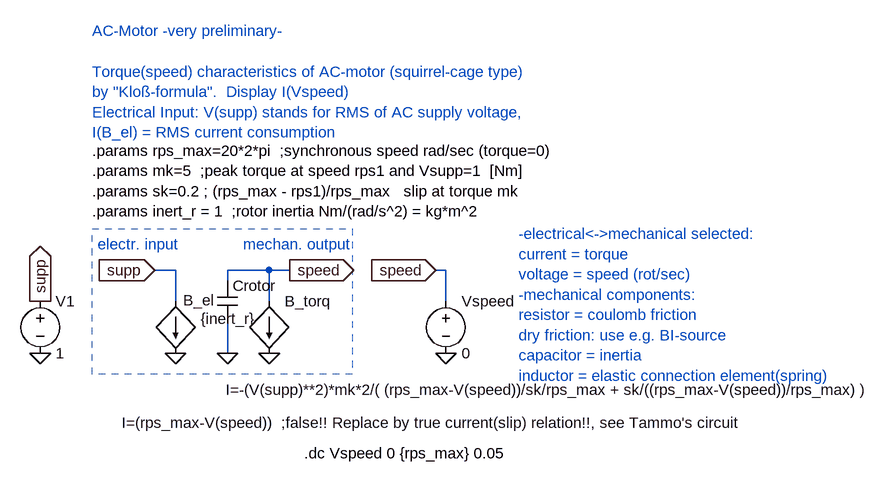
[diagram p0: schematic AC_motor_torque_speed.asc]
AC_motor_torque_speed.asc, the LTspice schematic file:
Version 4
SHEET 1 1300 916
WIRE 96 144 64 144
WIRE 96 192 96 144
WIRE 176 160 176 144
WIRE 176 272 176 224
WIRE 240 144 176 144
WIRE 240 192 240 144
WIRE 272 144 240 144
WIRE 512 144 496 144
WIRE 512 192 512 144
FLAG 240 272 0
FLAG 512 272 0
FLAG 272 144 speed
IOPIN 272 144 Out
FLAG -112 272 0
FLAG -112 192 supp
IOPIN -112 192 Out
FLAG 96 272 0
FLAG 64 144 supp
IOPIN 64 144 In
FLAG 496 144 speed
IOPIN 496 144 In
FLAG 176 272 0
SYMBOL bi 240 192 R0
WINDOW 3 -67 136 Left 0
SYMATTR Value I=-(V(supp)**2)*mk*2/( (rps_max-V(speed))/sk/rps_max + sk/((rps_max-V(speed))/rps_max) )
SYMATTR InstName B_torq
SYMBOL voltage 512 176 R0
WINDOW 123 0 0 Left 0
WINDOW 39 0 0 Left 0
SYMATTR InstName Vspeed
SYMATTR Value 0
SYMBOL voltage -112 176 R0
WINDOW 123 0 0 Left 0
WINDOW 39 0 0 Left 0
SYMATTR InstName V1
SYMATTR Value 1
SYMBOL bi 96 192 R0
WINDOW 3 -83 187 Left 0
WINDOW 0 12 -2 Left 0
SYMATTR Value I=(rps_max-V(speed))  ;false!! Replace by true current(slip) relation!!, see Tammo's circuit
SYMATTR InstName B_el
SYMBOL cap 160 160 R0
WINDOW 3 -25 59 Left 0
SYMATTR Value {inert_r}
SYMATTR InstName Crotor
TEXT -32 -40 Left 0 !.params rps_max=20*2*pi  ;synchronous speed rad/sec (torque=0)\n.params mk=5  ;peak torque at speed rps1 and Vsupp=1  [Nm]\n.params sk=0.2 ; (rps_max - rps1)/rps_max   slip at torque mk\n.params inert_r = 1  ;rotor inertia Nm/(rad/s^2) = kg*m^2
TEXT 294 426 Left 0 !.dc Vspeed 0 {rps_max} 0.05
TEXT 624 88 Left 0 ;-electrical<->mechanical selected:\ncurrent = torque\nvoltage = speed (rot/sec) \n-mechanical components:\nresistor = coulomb friction\ndry friction: use e.g. BI-source\ncapacitor = inertia\ninductor = elastic connection element(spring)
TEXT -32 -224 Left 0 ;AC-Motor -very preliminary-\n \nTorque(speed) characteristics of AC-motor (squirrel-cage type)\nby "Kloß-formula".  Display I(Vspeed)\nElectrical Input: V(supp) stands for RMS of AC supply voltage,\nI(B_el) = RMS current consumption
TEXT -24 104 Left 0 ;electr. input
TEXT 200 104 Left 0 ;mechan. output
RECTANGLE Normal 368 304 -32 80 2

The netlist it stands for:
* AC_motor_torque_speed.asc
B_torq speed 0 I=-(V(supp)**2)*mk*2/( (rps_max-V(speed))/sk/rps_max + sk/((rps_max-V(speed))/rps_max) )
Vspeed speed 0 0
V1 supp 0 1
B_el supp 0 I=(rps_max-V(speed))  ;false!! Replace by true current(slip) relation!!, see Tammo's circuit
Crotor speed 0 {inert_r}
.params rps_max=20*2*pi  ;synchronous speed rad/sec (torque=0)
.params mk=5  ;peak torque at speed rps1 and Vsupp=1  [Nm]
.params sk=0.2 ; (rps_max - rps1)/rps_max   slip at torque mk
.params inert_r = 1  ;rotor inertia Nm/(rad/s^2) = kg*m^2
.dc Vspeed 0 {rps_max} 0.05
* -electrical<->mechanical selected:
* current = torque
* voltage = speed (rot/sec)
* -mechanical components:
* resistor = coulomb friction
* dry friction: use e.g. BI-source
* capacitor = inertia
* inductor = elastic connection element(spring)
* AC-Motor -very preliminary-
* Torque(speed) characteristics of AC-motor (squirrel-cage type)
* by "Kloß-formula".  Display I(Vspeed)
* Electrical Input: V(supp) stands for RMS of AC supply voltage,
* I(B_el) = RMS current consumption
* electr. input
* mechan. output
.backanno
.end